# Altium schematic sheet as14120_x31_ddr.SchDoc
size A3; PageSetup: Record=PageOptions|CenterHorizontal=True|CenterVertical=True|PrintScale=1.05|XCorrection=1.00|YCorrection=1.00|PrintKind=0|BorderSize=5000000|LeftOffset=0|BottomOffset=0|Orientation=2|PaperLength=3060|PaperWidth=2190|Scale=100|PaperSource=7|PrintQuality=-4|MediaType=1|DitherType=10|PaperKind=A3 (без полей / бумага продольной резки) (297 x 420 мм)|PrintScaleMode=1
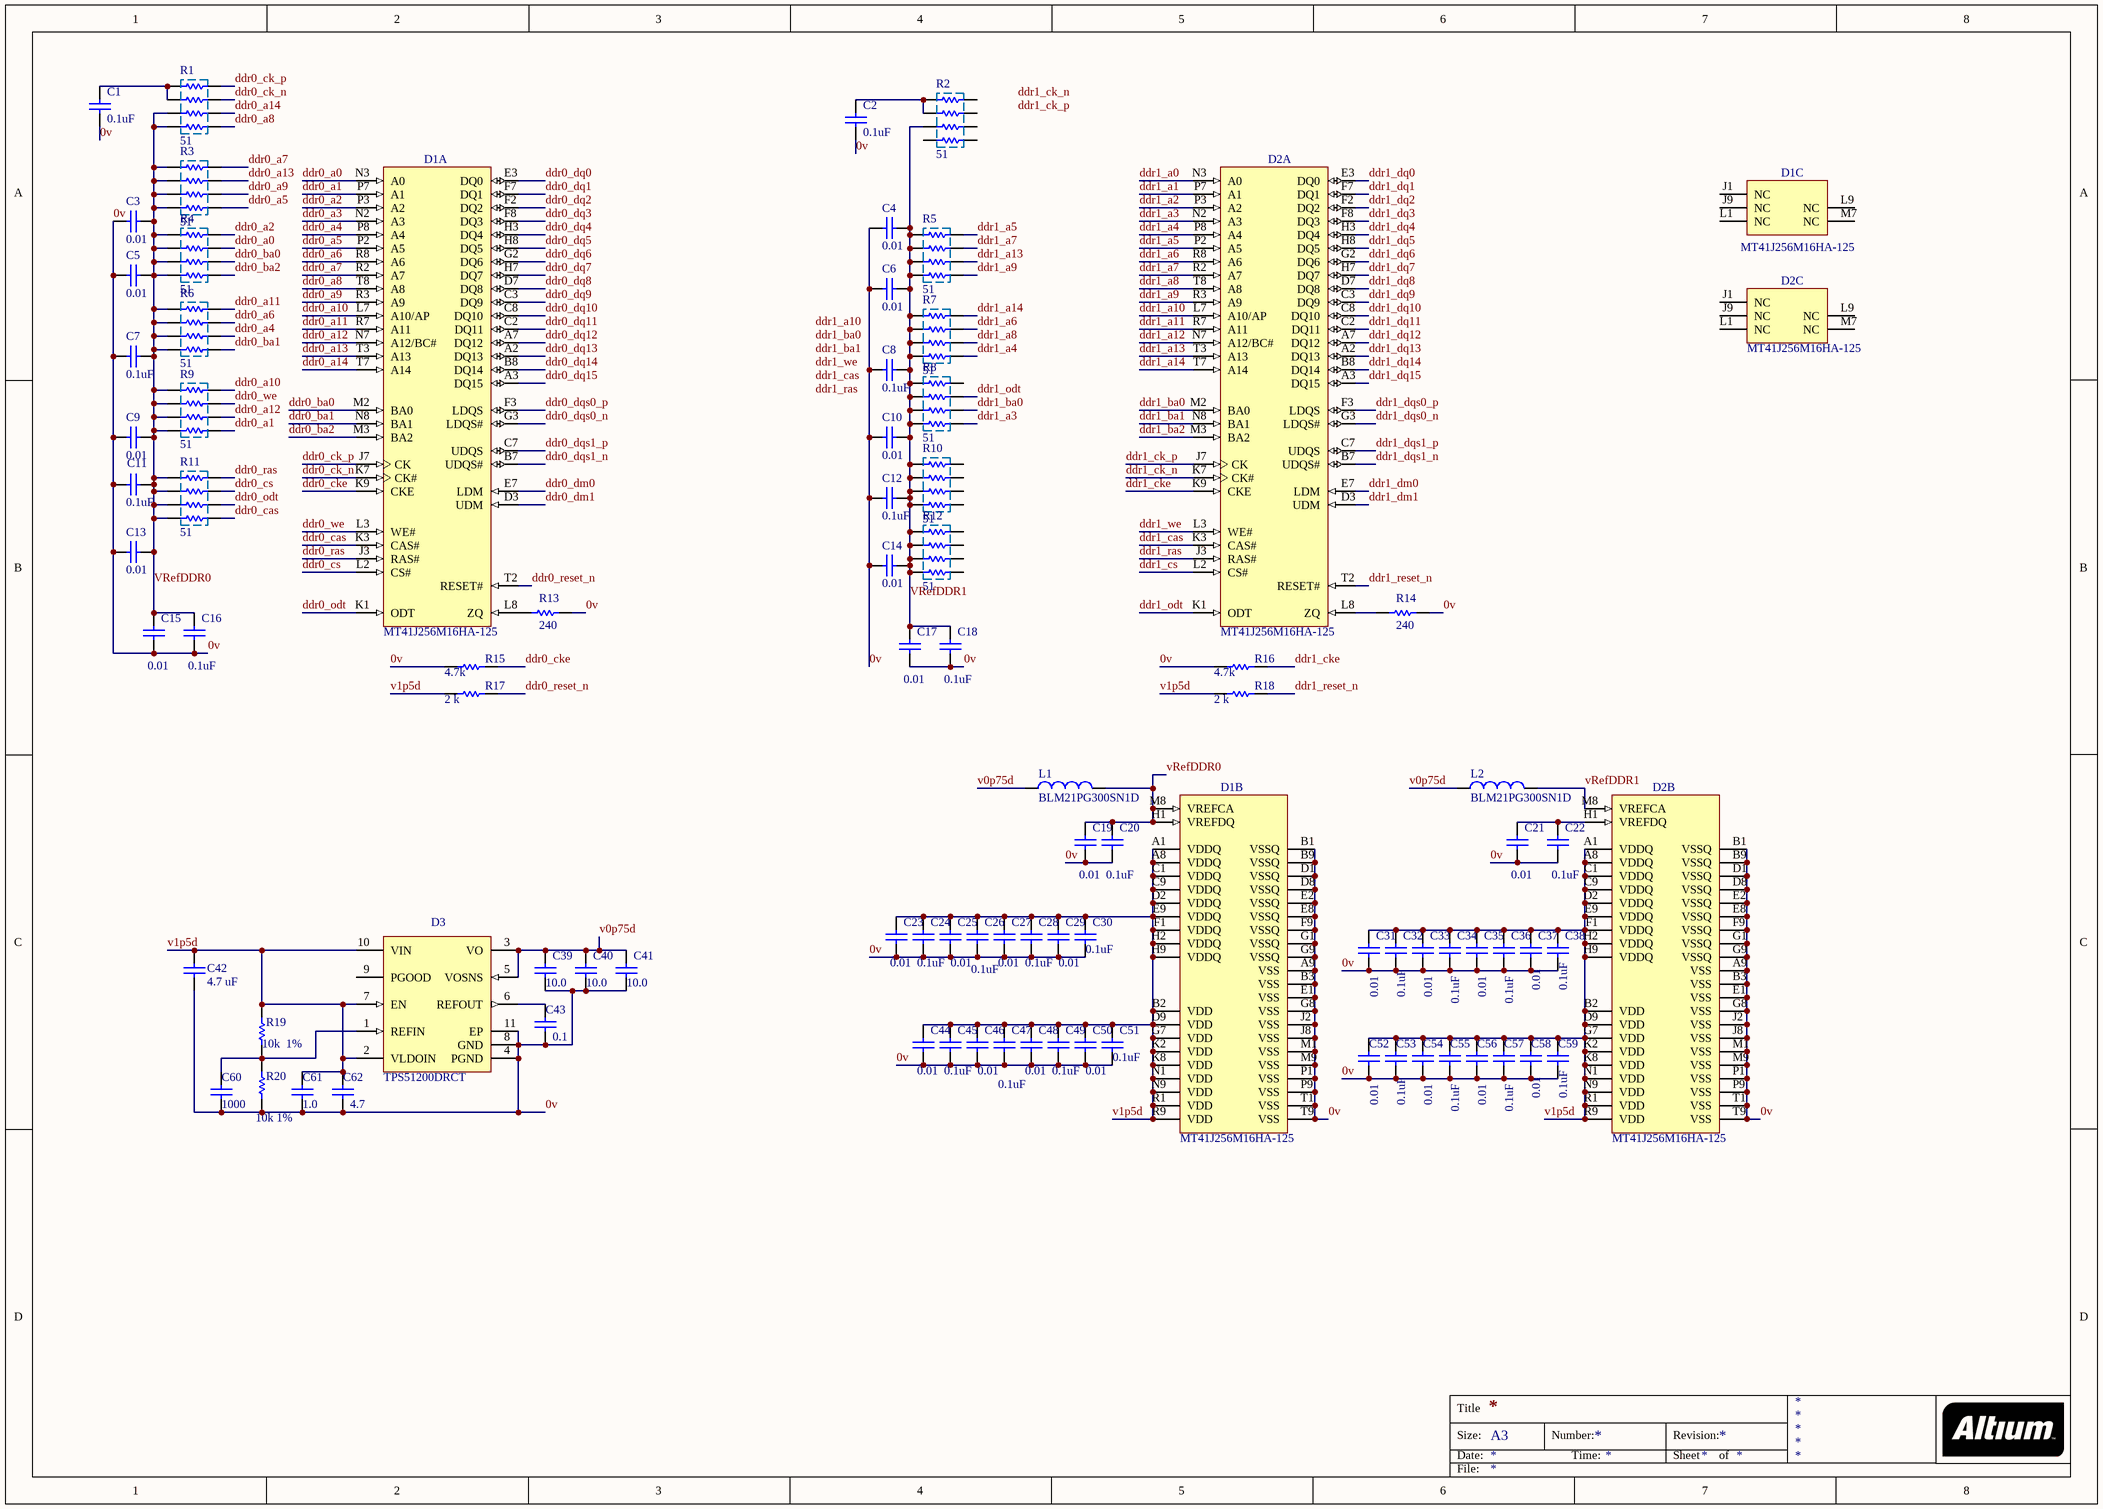
[diagram p0: as14120_x31_ddr.SchDoc]

## Parts
C1  value 0.1uF  [CAPC0402(1005)60_M]  (hidden comment: CAP 1uF 10V 0402(1005))
C2  value 0.1uF  [CAPC0402(1005)60_M]  (hidden comment: CAP 1uF 10V 0402(1005))
C3  value 0.01  [CAPC0402(1005)60_M]  (hidden comment: CAP 1uF 10V 0402(1005))
C4  value 0.01  [CAPC0402(1005)60_M]  (hidden comment: CAP 1uF 10V 0402(1005))
C5  value 0.01  [CAPC0402(1005)60_M]  (hidden comment: CAP 1uF 10V 0402(1005))
C6  value 0.01  [CAPC0402(1005)60_M]  (hidden comment: CAP 1uF 10V 0402(1005))
C7  value 0.1uF  [CAPC0402(1005)60_M]  (hidden comment: CAP 1uF 10V 0402(1005))
C8  value 0.1uF  [CAPC0402(1005)60_M]  (hidden comment: CAP 1uF 10V 0402(1005))
C9  value 0.01  [CAPC0402(1005)60_M]  (hidden comment: CAP 1uF 10V 0402(1005))
C10  value 0.01  [CAPC0402(1005)60_M]  (hidden comment: CAP 1uF 10V 0402(1005))
C11  value 0.1uF  [CAPC0402(1005)60_M]  (hidden comment: CAP 1uF 10V 0402(1005))
C12  value 0.1uF  [CAPC0402(1005)60_M]  (hidden comment: CAP 1uF 10V 0402(1005))
C13  value 0.01  [CAPC0402(1005)60_M]  (hidden comment: CAP 1uF 10V 0402(1005))
C14  value 0.01  [CAPC0402(1005)60_M]  (hidden comment: CAP 1uF 10V 0402(1005))
C15  value 0.01  [CAPC0402(1005)60_M]  (hidden comment: CAP 1uF 10V 0402(1005))
C16  value 0.1uF  [CAPC0402(1005)60_M]  (hidden comment: CAP 1uF 10V 0402(1005))
C17  value 0.01  [CAPC0402(1005)60_M]  (hidden comment: CAP 1uF 10V 0402(1005))
C18  value 0.1uF  [CAPC0402(1005)60_M]  (hidden comment: CAP 1uF 10V 0402(1005))
C19  value 0.01  [CAPC0402(1005)60_M]  (hidden comment: CAP 1uF 10V 0402(1005))
C20  value 0.1uF  [CAPC0402(1005)60_M]  (hidden comment: CAP 1uF 10V 0402(1005))
C21  value 0.01  [CAPC0402(1005)60_M]  (hidden comment: CAP 1uF 10V 0402(1005))
C22  value 0.1uF  [CAPC0402(1005)60_M]  (hidden comment: CAP 1uF 10V 0402(1005))
C23  value 0.01  [CAPC0402(1005)60_M]  (hidden comment: CAP 1uF 10V 0402(1005))
C24  value 0.1uF  [CAPC0402(1005)60_M]  (hidden comment: CAP 1uF 10V 0402(1005))
C25  value 0.01  [CAPC0402(1005)60_M]  (hidden comment: CAP 1uF 10V 0402(1005))
C26  value 0.1uF  [CAPC0402(1005)60_M]  (hidden comment: CAP 1uF 10V 0402(1005))
C27  value 0.01  [CAPC0402(1005)60_M]  (hidden comment: CAP 1uF 10V 0402(1005))
C28  value 0.1uF  [CAPC0402(1005)60_M]  (hidden comment: CAP 1uF 10V 0402(1005))
C29  value 0.01  [CAPC0402(1005)60_M]  (hidden comment: CAP 1uF 10V 0402(1005))
C30  value 0.1uF  [CAPC0402(1005)60_M]  (hidden comment: CAP 1uF 10V 0402(1005))
C31  value 0.01  [CAPC0402(1005)60_M]  (hidden comment: CAP 1uF 10V 0402(1005))
C32  value 0.1uF  [CAPC0402(1005)60_M]  (hidden comment: CAP 1uF 10V 0402(1005))
C33  value 0.01  [CAPC0402(1005)60_M]  (hidden comment: CAP 1uF 10V 0402(1005))
C34  value 0.1uF  [CAPC0402(1005)60_M]  (hidden comment: CAP 1uF 10V 0402(1005))
C35  value 0.01  [CAPC0402(1005)60_M]  (hidden comment: CAP 1uF 10V 0402(1005))
C36  value 0.1uF  [CAPC0402(1005)60_M]  (hidden comment: CAP 1uF 10V 0402(1005))
C37  value 0.01  [CAPC0402(1005)60_M]  (hidden comment: CAP 1uF 10V 0402(1005))
C38  value 0.1uF  [CAPC0402(1005)60_M]  (hidden comment: CAP 1uF 10V 0402(1005))
C39  value 10.0  [CAPC0805(2012)100_N]  (hidden comment: CAP_0805)
C40  value 10.0  [CAPC0805(2012)100_N]  (hidden comment: CAP_0805)
C41  value 10.0  [CAPC0805(2012)100_N]  (hidden comment: CAP_0805)
C42  value 4.7 uF  [CAPC0805(2012)100_N]  (hidden comment: CAP_0805)
C43  value 0.1  [CAPC0805(2012)100_N]  (hidden comment: CAP_0805)
C44  value 0.01  [CAPC0402(1005)60_M]  (hidden comment: CAP 1uF 10V 0402(1005))
C45  value 0.1uF  [CAPC0402(1005)60_M]  (hidden comment: CAP 1uF 10V 0402(1005))
C46  value 0.01  [CAPC0402(1005)60_M]  (hidden comment: CAP 1uF 10V 0402(1005))
C47  value 0.1uF  [CAPC0402(1005)60_M]  (hidden comment: CAP 1uF 10V 0402(1005))
C48  value 0.01  [CAPC0402(1005)60_M]  (hidden comment: CAP 1uF 10V 0402(1005))
C49  value 0.1uF  [CAPC0402(1005)60_M]  (hidden comment: CAP 1uF 10V 0402(1005))
C50  value 0.01  [CAPC0402(1005)60_M]  (hidden comment: CAP 1uF 10V 0402(1005))
C51  value 0.1uF  [CAPC0402(1005)60_M]  (hidden comment: CAP 1uF 10V 0402(1005))
C52  value 0.01  [CAPC0402(1005)60_M]  (hidden comment: CAP 1uF 10V 0402(1005))
C53  value 0.1uF  [CAPC0402(1005)60_M]  (hidden comment: CAP 1uF 10V 0402(1005))
C54  value 0.01  [CAPC0402(1005)60_M]  (hidden comment: CAP 1uF 10V 0402(1005))
C55  value 0.1uF  [CAPC0402(1005)60_M]  (hidden comment: CAP 1uF 10V 0402(1005))
C56  value 0.01  [CAPC0402(1005)60_M]  (hidden comment: CAP 1uF 10V 0402(1005))
C57  value 0.1uF  [CAPC0402(1005)60_M]  (hidden comment: CAP 1uF 10V 0402(1005))
C58  value 0.01  [CAPC0402(1005)60_M]  (hidden comment: CAP 1uF 10V 0402(1005))
C59  value 0.1uF  [CAPC0402(1005)60_M]  (hidden comment: CAP 1uF 10V 0402(1005))
C60  value 1000  [CAPC0805(2012)100_N]  (hidden comment: CAP_0805)
C61  value 1.0  [CAPC0805(2012)100_N]  (hidden comment: CAP_0805)
C62  value 4.7  [CAPC0805(2012)100_N]  (hidden comment: CAP_0805)
D1  MT41J256M16HA-125  [MICT-HA-96]  (parts A,B,C of 3)
D2  MT41J256M16HA-125  [MICT-HA-96]  (parts A,B,C of 3)
D3  TPS51200DRCT  [TI-DRC10-2400X1650TP_V]
L1  BLM21PG300SN1D  [CAPC0805(2012)100_N]
L2  BLM21PG300SN1D  [CAPC0805(2012)100_N]
R1  51  [CAY16]
R2  51  [CAY16]
R3  51  [CAY16]
R4  51  [CAY16]
R5  51  [CAY16]
R6  51  [CAY16]
R7  51  [CAY16]
R8  51  [CAY16]
R9  51  [CAY16]
R10  51  [CAY16]
R11  51  [CAY16]
R12  51  [CAY16]
R13  value 240  [RESC0805(2012)_L]  (hidden comment: 1K 1% 0805(2012))
R14  value 240  [RESC0805(2012)_L]  (hidden comment: 1K 1% 0805(2012))
R15  value 4.7k  [RESC0805(2012)_L]  (hidden comment: 1K 1% 0805(2012))
R16  value 4.7k  [RESC0805(2012)_L]  (hidden comment: 1K 1% 0805(2012))
R17  value 2 k  [RESC0805(2012)_L]  (hidden comment: 1K 1% 0805(2012))
R18  value 2 k  [RESC0805(2012)_L]  (hidden comment: 1K 1% 0805(2012))
R19  value 10k  1%  [RESC0805(2012)_L]  (hidden comment: 1K 1% 0805(2012))
R20  value 10k 1%  [RESC0805(2012)_L]  (hidden comment: 1K 1% 0805(2012))

## Nets
0v: C1.1 C2.1 C3.2 C4.2 C5.2 C6.2 C7.2 C8.2 C9.2 C10.2 C11.2 C12.2 C13.2 C14.2 C15.1 C16.1 C17.1 C18.1 C19.1 C20.1 C21.1 C22.1 C23.1 C24.1 C25.1 C26.1 C27.1 C28.1 C29.1 C30.1 C31.1 C32.1 C33.1 C34.1 C35.1 C36.1 C37.1 C38.1 C39.1 C40.1 C41.1 C42.1 C43.1 C44.1 C45.1 C46.1 C47.1 C48.1 C49.1 C50.1 C51.1 C52.1 C53.1 C54.1 C55.1 C56.1 C57.1 C58.1 C59.1 C60.1 C61.1 C62.1 D1.A9(VSS) D1.B1(VSSQ) D1.B3(VSS) D1.B9(VSSQ) D1.D1(VSSQ) D1.D8(VSSQ) D1.E1(VSS) D1.E2(VSSQ) D1.E8(VSSQ) D1.F9(VSSQ) D1.G1(VSSQ) D1.G8(VSS) D1.G9(VSSQ) D1.J2(VSS) D1.J8(VSS) D1.M1(VSS) D1.M9(VSS) D1.P1(VSS) D1.P9(VSS) D1.T1(VSS) D1.T9(VSS) D2.A9(VSS) D2.B1(VSSQ) D2.B3(VSS) D2.B9(VSSQ) D2.D1(VSSQ) D2.D8(VSSQ) D2.E1(VSS) D2.E2(VSSQ) D2.E8(VSSQ) D2.F9(VSSQ) D2.G1(VSSQ) D2.G8(VSS) D2.G9(VSSQ) D2.J2(VSS) D2.J8(VSS) D2.M1(VSS) D2.M9(VSS) D2.P1(VSS) D2.P9(VSS) D2.T1(VSS) D2.T9(VSS) D3.4(PGND) D3.8(GND) D3.11(EP) R13.2 R14.2 R15.1 R16.1 R20.1
ddr0_a0: D1.N3(A0) R4.7
ddr0_a1: D1.P7(A1) R9.5
ddr0_a2: D1.P3(A2) R4.8
ddr0_a3: D1.N2(A3)
ddr0_a4: D1.P8(A4) R6.6
ddr0_a5: D1.P2(A5) R3.5
ddr0_a6: D1.R8(A6) R6.7
ddr0_a7: D1.R2(A7) R3.8
ddr0_a8: D1.T8(A8) R1.5
ddr0_a9: D1.R3(A9) R3.6
ddr0_a10: D1.L7(A10/AP) R9.8
ddr0_a11: D1.R7(A11) R6.8
ddr0_a12: D1.N7(A12/BC#) R9.6
ddr0_a13: D1.T3(A13) R3.7
ddr0_a14: D1.T7(A14) R1.6
ddr0_ba0: D1.M2(BA0) R4.6
ddr0_ba1: D1.N8(BA1) R6.5
ddr0_ba2: D1.M3(BA2) R4.5
ddr0_cas: D1.K3(CAS#) R11.5
ddr0_ck_n: D1.K7(CK#) R1.7
ddr0_ck_p: D1.J7(CK) R1.8
ddr0_cke: D1.K9(CKE) R15.2
ddr0_cs: D1.L2(CS#) R11.7
ddr0_dm0: D1.E7(LDM)
ddr0_dm1: D1.D3(UDM)
ddr0_dq0: D1.E3(DQ0)
ddr0_dq1: D1.F7(DQ1)
ddr0_dq2: D1.F2(DQ2)
ddr0_dq3: D1.F8(DQ3)
ddr0_dq4: D1.H3(DQ4)
ddr0_dq5: D1.H8(DQ5)
ddr0_dq6: D1.G2(DQ6)
ddr0_dq7: D1.H7(DQ7)
ddr0_dq8: D1.D7(DQ8)
ddr0_dq9: D1.C3(DQ9)
ddr0_dq10: D1.C8(DQ10)
ddr0_dq11: D1.C2(DQ11)
ddr0_dq12: D1.A7(DQ12)
ddr0_dq13: D1.A2(DQ13)
ddr0_dq14: D1.B8(DQ14)
ddr0_dq15: D1.A3(DQ15)
ddr0_dqs0_n: D1.G3(LDQS#)
ddr0_dqs0_p: D1.F3(LDQS)
ddr0_dqs1_n: D1.B7(UDQS#)
ddr0_dqs1_p: D1.C7(UDQS)
ddr0_odt: D1.K1(ODT) R11.6
ddr0_ras: D1.J3(RAS#) R11.8
ddr0_reset_n: D1.T2(RESET#) R17.2
ddr0_we: D1.L3(WE#) R9.7
ddr1_a0: D2.N3(A0)
ddr1_a1: D2.P7(A1)
ddr1_a2: D2.P3(A2)
ddr1_a3: D2.N2(A3) R8.5
ddr1_a4: D2.P8(A4) R7.5
ddr1_a5: D2.P2(A5) R5.8
ddr1_a6: D2.R8(A6) R7.7
ddr1_a7: D2.R2(A7) R5.7
ddr1_a8: D2.T8(A8) R7.6
ddr1_a9: D2.R3(A9) R5.5
ddr1_a10: D2.L7(A10/AP)
ddr1_a11: D2.R7(A11)
ddr1_a12: D2.N7(A12/BC#)
ddr1_a13: D2.T3(A13) R5.6
ddr1_a14: D2.T7(A14) R7.8
ddr1_ba0: D2.M2(BA0) R8.6
ddr1_ba1: D2.N8(BA1)
ddr1_ba2: D2.M3(BA2)
ddr1_cas: D2.K3(CAS#)
ddr1_ck_n: D2.K7(CK#)
ddr1_ck_p: D2.J7(CK)
ddr1_cke: D2.K9(CKE) R16.2
ddr1_cs: D2.L2(CS#)
ddr1_dm0: D2.E7(LDM)
ddr1_dm1: D2.D3(UDM)
ddr1_dq0: D2.E3(DQ0)
ddr1_dq1: D2.F7(DQ1)
ddr1_dq2: D2.F2(DQ2)
ddr1_dq3: D2.F8(DQ3)
ddr1_dq4: D2.H3(DQ4)
ddr1_dq5: D2.H8(DQ5)
ddr1_dq6: D2.G2(DQ6)
ddr1_dq7: D2.H7(DQ7)
ddr1_dq8: D2.D7(DQ8)
ddr1_dq9: D2.C3(DQ9)
ddr1_dq10: D2.C8(DQ10)
ddr1_dq11: D2.C2(DQ11)
ddr1_dq12: D2.A7(DQ12)
ddr1_dq13: D2.A2(DQ13)
ddr1_dq14: D2.B8(DQ14)
ddr1_dq15: D2.A3(DQ15)
ddr1_dqs0_n: D2.G3(LDQS#)
ddr1_dqs0_p: D2.F3(LDQS)
ddr1_dqs1_n: D2.B7(UDQS#)
ddr1_dqs1_p: D2.C7(UDQS)
ddr1_odt: D2.K1(ODT) R8.7
ddr1_ras: D2.J3(RAS#)
ddr1_reset_n: D2.T2(RESET#) R18.2
ddr1_we: D2.L3(WE#)
v0p75d: C39.2 C40.2 C41.2 D3.3(VO) D3.5(VOSNS) L1.1 L2.1
v1p5d: C23.2 C24.2 C25.2 C26.2 C27.2 C28.2 C29.2 C30.2 C31.2 C32.2 C33.2 C34.2 C35.2 C36.2 C37.2 C38.2 C42.2 C44.2 C45.2 C46.2 C47.2 C48.2 C49.2 C50.2 C51.2 C52.2 C53.2 C54.2 C55.2 C56.2 C57.2 C58.2 C59.2 C61.2 C62.2 D1.A1(VDDQ) D1.A8(VDDQ) D1.B2(VDD) D1.C1(VDDQ) D1.C9(VDDQ) D1.D2(VDDQ) D1.D9(VDD) D1.E9(VDDQ) D1.F1(VDDQ) D1.G7(VDD) D1.H2(VDDQ) D1.H9(VDDQ) D1.K2(VDD) D1.K8(VDD) D1.N1(VDD) D1.N9(VDD) D1.R1(VDD) D1.R9(VDD) D2.A1(VDDQ) D2.A8(VDDQ) D2.B2(VDD) D2.C1(VDDQ) D2.C9(VDDQ) D2.D2(VDDQ) D2.D9(VDD) D2.E9(VDDQ) D2.F1(VDDQ) D2.G7(VDD) D2.H2(VDDQ) D2.H9(VDDQ) D2.K2(VDD) D2.K8(VDD) D2.N1(VDD) D2.N9(VDD) D2.R1(VDD) D2.R9(VDD) D3.2(VLDOIN) D3.7(EN) D3.10(VIN) R17.1 R18.1 R19.2
vRefDDR0: C3.1 C5.1 C7.1 C9.1 C11.1 C13.1 C15.2 C16.2 C19.2 C20.2 D1.H1(VREFDQ) D1.M8(VREFCA) L1.2 R1.3 R1.4 R3.1 R3.2 R3.3 R3.4 R4.1 R4.2 R4.3 R4.4 R6.1 R6.2 R6.3 R6.4 R9.1 R9.2 R9.3 R9.4 R11.1 R11.2 R11.3 R11.4
vRefDDR1: C4.1 C6.1 C8.1 C10.1 C12.1 C14.1 C17.2 C18.2 D2.M8(VREFCA) L2.2 R2.3 R5.1 R5.2 R5.3 R5.4 R7.1 R7.2 R7.3 R7.4 R8.1 R8.2 R8.3 R8.4 R10.1 R10.2 R10.3 R10.4 R12.1 R12.2 R12.3 R12.4
NetC1_2: C1.2 R1.1 R1.2
NetC2_2: C2.2 R2.1 R2.2
NetC21_2: C21.2 C22.2 D2.H1(VREFDQ)
NetC43_2: C43.2 D3.6(REFOUT)
NetC60_2: C60.2 D3.1(REFIN) R19.1 R20.2
NetD1_L8: D1.L8(ZQ) R13.1
NetD2_L8: D2.L8(ZQ) R14.1

Not connected (* = marked no-connect by the designer): D1 J1(NC) J9(NC) L1(NC) L9(NC) M7(NC); D2 J1(NC) J9(NC) L1(NC) L9(NC) M7(NC); D3 9(PGOOD); R2 4 5 6 7 8; R8 8; R10 5 6 7 8; R12 5 6 7 8

## Notes on the sheet
- Labels drawn without touching a wire or pin: ddr1_a10, ddr1_ba0, ddr1_ba1, ddr1_cas, ddr1_ck_n, ddr1_ck_p, ddr1_ras, ddr1_we
- Title
- Size:
- Date:
- A3
- Number:
- Time:
- Revision:
- Sheet
- of
- File:

## Library data of the parts
C1-C38 C44-C59 = CAP_0402: CAP 1uF 10V ±20% 0402 (1005 Metric) Thickness 0.6mm SMD; Case-Metric: 1005; Case-EIA: 0402; Tolerance: ±20%; Max Thickness: 0.6 mm; Rated Voltage: 10 V; Technology: SMT
D1 D2 = MT41J256M16HA-125: 4Gb DDR3-1600 SDRAM, 256Mb x 16, 1.25ns, 1.5V, 0 to 95 degC, 96-Ball FBGA, Pb-Free; Manufacturer: Micron; CL: CL = 11; Clock Rate: 800 MHz; Op. Temp.: 0C to +95C; DatasheetVersion: Rev.J; PackageVersion: Rev.E; PackageReference: MICT-HA-96; PackageDescription: 96-Ball Fine-Pitch Ball Grid Array, 14 x 9 mm, Pitch 0.8 mm; Cycle Time: 1.25ns; Data Rate: DDR3-1600; Density: 4Gb; Depth: 256Mb; Package: FBGA; Pin Count: 96-ball; RoHS: Yes; Voltage: 1.5V; Width: x16; Mounting Technology: Surface Mount; PartNumber: MT41J256M16HA-125; ComponentLink1Description: Manufacturer URL; ComponentLink1URL: http://www.micron.com/; ComponentLink2Description: Datasheet; ComponentLink2URL: http://www.micron.com/~/media/Documents/Products/Data%20Sheet/DRAM/4Gb_DDR3_SDRAM.pdf; ComponentLink3Description: Package Specification; ComponentLink3URL: http://www.micron.com/~/media/Documents/Products/Data%20Sheet/DRAM/4Gb_1_35V_DDR3L.pdf
D3 = TPS51200DRCT: Single Output LDO, 3 A, 2.375 to 3.5 V Input, with DDR Termination, 10-pin SON (DRC), -40 to 85 degC, Green (RoHS & no Sb/Br); Manufacturer: Texas Instruments; Iout(Max)(A): 3; Iq(Typ)(mA): 0.5; Power Good: TRUE; Rating: Catalog; SubFamily: Single Channel LDO; Vin(Max)(V): 3.5; Vin(Min)(V): 2.3; DatasheetVersion: SLUS812; PackageVersion: 4204102-3/L; PackageReference: DRC10-2400X1650TP; PackageDescription: 10-Pin Plastic Small Outline, Body 3 x 3 mm, Pitch 0.5 mm; Supplier 1: Digi-Key; Supplier Part Number 1: 296-23830-2-ND; Supplier 2: Digi-Key; Supplier Part Number 2: 296-23830-1-ND; Supplier 3: Digi-Key; Supplier Part Number 3: 296-23830-6-ND; Supplier 4: Farnell; Supplier Part Number 4: 1903398; Supplier 5: Newark; Supplier Part Number 5: 01P3287; Supplier 6: Newark; Supplier Part Number 6: 11N9833; Supplier 7: Mouser; Supplier Part Number 7: 595-TPS51200DRCT; Eco-Plan: Green (RoHS & no Sb/Br); Mounting Technology: Surface Mount; PartNumber: TPS51200DRCT; ComponentLink1Description: Manufacturer URL; ComponentLink1URL: http://www.ti.com/; ComponentLink2Description: Datasheet; ComponentLink2URL: http://www.ti.com/general/docs/lit/getliterature.tsp?genericPartNumber=TPS51200&fileType=pdf; ComponentLink3Description: Package Specification; ComponentLink3URL: http://www.ti.com/litv/pdf/mpds117k; ComponentLink4Description: URL Link1; ComponentLink4URL: Samples URL:http://www.ti.com/product/tps51200#samples
L1 L2 = Ferrite_beat
R1-R12 = cay16-J4: Value: 51
R13-R20 = RES_0805: 1K 0.125W 1% 0805 (2012 Metric)  SMD; Case-Metric: 2012; Case-EIA: 0805; Tolerance: 1 %; Power: 0.125 W; Technology: SMT